# Altium schematic sheet LTC2194_0.SchDoc
size A; DrawnBy: Daniel Schussheim; DocumentNumber: 2; SheetNumber: 5; SheetTotal: 24
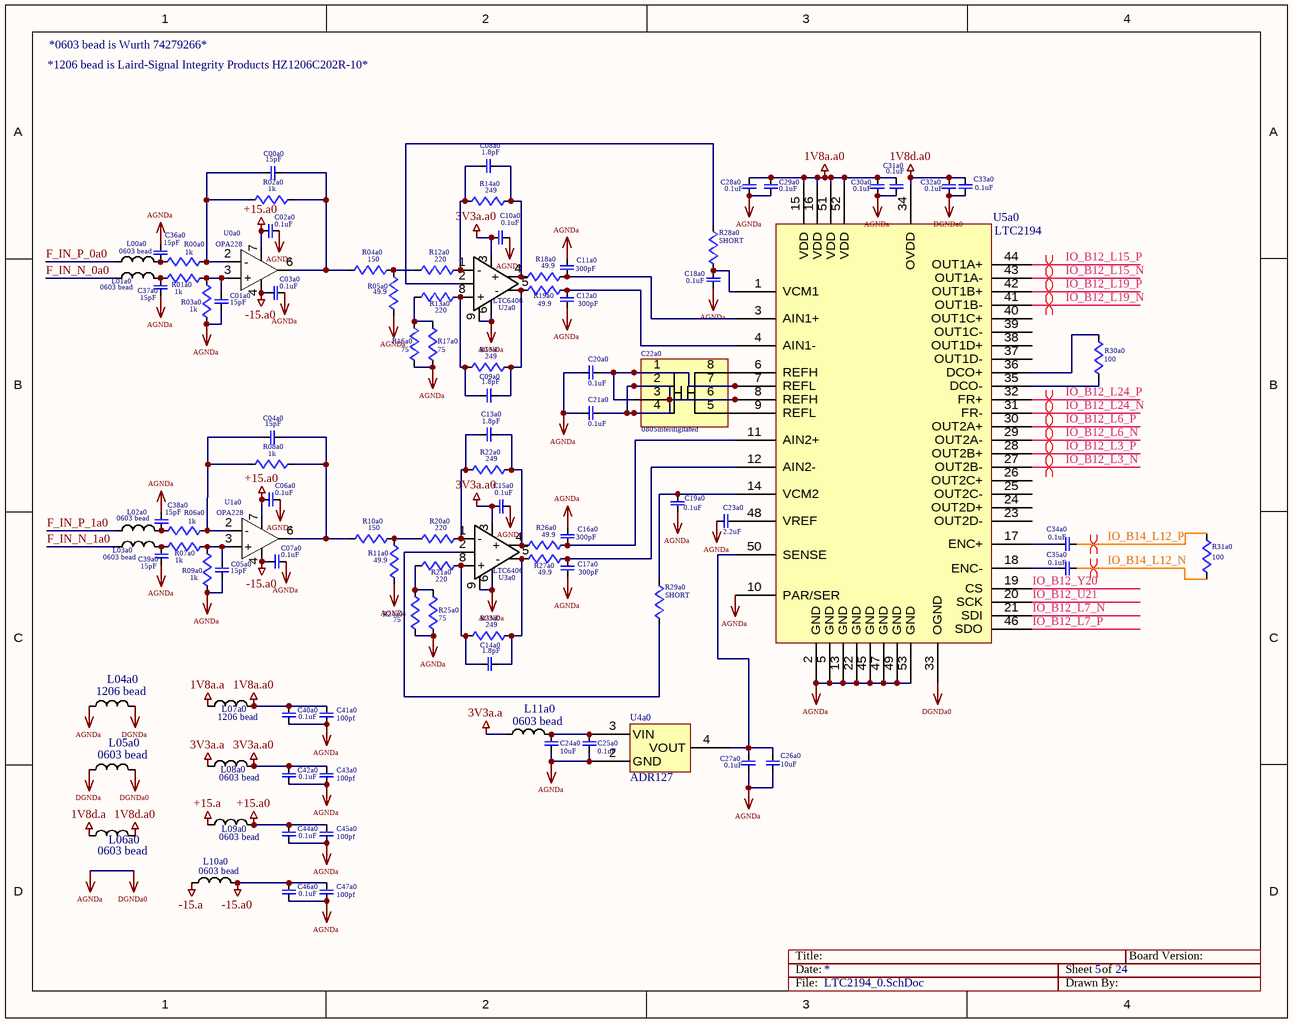
[diagram p0: LTC2194_0.SchDoc]

## Parts
C00a0  15pF  [0603]
C01a0  15pF  [0603]
C02a0  0.1uF  [0603]
C03a0  0.1uF  [0603]
C04a0  15pF  [0603]
C05a0  15pF  [0603]
C06a0  0.1uF  [0603]
C07a0  0.1uF  [0603]
C08a0  1.8pF  [0603]
C09a0  1.8pF  [0603]
C10a0  0.1uF  [0603]
C11a0  300pF  [0603]
C12a0  300pF  [0603]
C13a0  1.8pF  [0603]
C14a0  1.8pF  [0603]
C15a0  0.1uF  [0603]
C16a0  300pF  [0603]
C17a0  300pF  [0603]
C18a0  0.1uF  [0402]
C19a0  0.1uF  [0402]
C20a0  0.1uF  [0402]
C21a0  0.1uF  [0402]
C22a0  0805interdigitated  [0805int]
C23a0  2.2uF  [0402]
C24a0  10uF  [0603]
C25a0  0.1uF  [0603]
C26a0  10uF  [0603]
C27a0  0.1uF  [0603]
C28a0  0.1uF  [0402]
C29a0  0.1uF  [0402]
C30a0  0.1uF  [0402]
C31a0  0.1uF  [0402]
C32a0  0.1uF  [0402]
C33a0  0.1uF  [0402]
C34a0  0.1uF  [0402]
C35a0  0.1uF  [0402]
C36a0  15pF  [0603]
C37a0  15pF  [0603]
C38a0  15pF  [0603]
C39a0  15pF  [0603]
C40a0  0.1uF  [0603]
C41a0  100pf  [0603]
C42a0  0.1uF  [0603]
C43a0  100pf  [0603]
C44a0  0.1uF  [0603]
C45a0  100pf  [0603]
C46a0  0.1uF  [0603]
C47a0  100pf  [0603]
L00a0  0603 bead  [0603]
L01a0  0603 bead  [0603]
L02a0  0603 bead  [0603]
L03a0  0603 bead  [0603]
L04a0  1206 bead  [1206]
L05a0  0603 bead  [0603]
L06a0  0603 bead  [0603]
L07a0  1206 bead  [1206]
L08a0  0603 bead  [0603]
L09a0  0603 bead  [0603]
L10a0  0603 bead  [0603]
L11a0  0603 bead  [0603]
R00a0  1k  [0603]
R01a0  1k  [0603]
R02a0  1k  [0603]
R03a0  1k  [0603]
R04a0  150  [0603]
R05a0  49.9  [0603]
R06a0  1k  [0603]
R07a0  1k  [0603]
R08a0  1k  [0603]
R09a0  1k  [0603]
R10a0  150  [0603]
R11a0  49.9  [0603]
R12a0  220  [0603]
R13a0  220  [0603]
R14a0  249  [0603]
R15a0  249  [0603]
R16a0  75  [0603]
R17a0  75  [0603]
R18a0  49.9  [0603]
R19a0  49.9  [0603]
R20a0  220  [0603]
R21a0  220  [0603]
R22a0  249  [0603]
R23a0  249  [0603]
R24a0  75  [0603]
R25a0  75  [0603]
R26a0  49.9  [0603]
R27a0  49.9  [0603]
R28a0  SHORT  [0603]
R29a0  SHORT  [0603]
R30a0  100  [0603]
R31a0  100  [0402]
U0a0  OPA228  [8SOIC]
U1a0  OPA228  [8SOIC]
U2a0  LTC6406  [8MSOP]
U3a0  LTC6406  [8MSOP]
U4a0  ADR127  [6TSOT]
U5a0  LTC2194  [52QFN]

## Nets
1V8a.a: L07a0.1
1V8a.a0: C28a0.1 C29a0.1 C30a0.1 C31a0.1 C40a0.1 C41a0.1 L07a0.2 U5a0.15(VDD) U5a0.16(VDD) U5a0.51(VDD) U5a0.52(VDD)
1V8d.a: L06a0.1
1V8d.a0: C32a0.1 C33a0.2 L06a0.2 U5a0.34(OVDD)
3V3a.a: L08a0.1 L11a0.1
3V3a.a0: C10a0.1 C15a0.1 C42a0.1 C43a0.1 L08a0.2 U2a0.3(V+) U3a0.3(V+)
+15.a: L09a0.1
+15.a0: C02a0.2 C06a0.2 C44a0.1 C45a0.1 L09a0.2 U0a0.7(V+) U1a0.7(V+)
-15.a: L10a0.1
-15.a0: C03a0.2 C07a0.2 C46a0.1 C47a0.1 L10a0.2 U0a0.4(V-) U1a0.4(V-)
AGNDa: C01a0.2 C02a0.1 C03a0.1 C05a0.2 C06a0.1 C07a0.1 C10a0.2 C11a0.2 C12a0.1 C15a0.2 C16a0.2 C17a0.1 C18a0.1 C19a0.1 C20a0.2 C21a0.2 C23a0.2 C24a0.2 C25a0.2 C26a0.2 C27a0.2 C28a0.2 C29a0.2 C30a0.2 C31a0.2 C32a0.2 C33a0.1 C36a0.1 C37a0.2 C38a0.1 C39a0.2 C40a0.2 C41a0.2 C42a0.2 C43a0.2 C44a0.2 C45a0.2 C46a0.2 C47a0.2 L04a0.1 L05a0.2 R03a0.1 R05a0.2 R09a0.1 R11a0.2 R16a0.2 R17a0.2 R24a0.2 R25a0.2 U2a0.6(V-) U2a0.9(V-) U3a0.6(V-) U3a0.9(V-) U4a0.2(GND) U5a0.2(GND) U5a0.5(GND) U5a0.10(PAR/SER) U5a0.13(GND) U5a0.22(GND) U5a0.33(OGND) U5a0.45(GND) U5a0.47(GND) U5a0.49(GND) U5a0.53(GND)  [also labelled DGNDa0]
DGNDa: L04a0.2 L05a0.1
F_IN_N_0a0: L01a0.1
F_IN_N_1a0: L03a0.1
F_IN_P_0a0: L00a0.1
F_IN_P_1a0: L02a0.1
IO_B12_L3_N: U5a0.27(OUT2B-)
IO_B12_L3_P: U5a0.28(OUT2B+)
IO_B12_L6_N: U5a0.29(OUT2A-)
IO_B12_L6_P: U5a0.30(OUT2A+)
IO_B12_L7_N: U5a0.21(SDI)
IO_B12_L7_P: U5a0.46(SDO)
IO_B12_L15_N: U5a0.43(OUT1A-)
IO_B12_L15_P: U5a0.44(OUT1A+)
IO_B12_L19_N: U5a0.41(OUT1B-)
IO_B12_L19_P: U5a0.42(OUT1B+)
IO_B12_L24_N: U5a0.31(FR-)
IO_B12_L24_P: U5a0.32(FR+)
IO_B12_U21: U5a0.20(SCK)
IO_B12_Y20: U5a0.19(CS)
IO_B14_L12_N: C35a0.1 R31a0.2
IO_B14_L12_P: C34a0.1 R31a0.1
NetC00a0_1: C00a0.1 R00a0.1 R02a0.2 U0a0.2(-)
NetC00a0_2: C00a0.2 R02a0.1 R04a0.2 U0a0.6(OUT)
NetC01a0_1: C01a0.1 R01a0.1 R03a0.2 U0a0.3(+)
NetC04a0_1: C04a0.1 R06a0.1 R08a0.2 U1a0.2(-)
NetC04a0_2: C04a0.2 R08a0.1 R10a0.2 U1a0.6(OUT)
NetC05a0_1: C05a0.1 R07a0.1 R09a0.2 U1a0.3(+)
NetC08a0_1: C08a0.1 R12a0.1 R14a0.2 U2a0.1(-)
NetC08a0_2: C08a0.2 R14a0.1 R18a0.2 U2a0.4(+)
NetC09a0_1: C09a0.1 R13a0.1 R15a0.2 U2a0.8(+)
NetC09a0_2: C09a0.2 R15a0.1 R19a0.2 U2a0.5(-)
NetC11a0_1: C11a0.1 R18a0.1 U5a0.3(AIN1+)
NetC12a0_2: C12a0.2 R19a0.1 U5a0.4(AIN1-)
NetC13a0_1: C13a0.1 R20a0.1 R22a0.2 U3a0.1(-)
NetC13a0_2: C13a0.2 R22a0.1 R26a0.2 U3a0.4(+)
NetC14a0_1: C14a0.1 R21a0.1 R23a0.2 U3a0.8(+)
NetC14a0_2: C14a0.2 R23a0.1 R27a0.2 U3a0.5(-)
NetC16a0_1: C16a0.1 R26a0.1 U5a0.11(AIN2+)
NetC17a0_2: C17a0.2 R27a0.1 U5a0.12(AIN2-)
NetC18a0_2: C18a0.2 R28a0.2 U5a0.1(VCM1)
NetC19a0_2: C19a0.2 R29a0.1 U5a0.14(VCM2)
NetC20a0_1: C20a0.1 C22a0.1 C22a0.3 C22a0.7 U5a0.7(REFL)
NetC21a0_1: C21a0.1 C22a0.2 C22a0.4 C22a0.6 U5a0.8(REFH)
NetC22a0_5: C22a0.5 U5a0.9(REFL)
NetC22a0_8: C22a0.8 U5a0.6(REFH)
NetC23a0_1: C23a0.1 U5a0.48(VREF)
NetC24a0_1: C24a0.1 C25a0.1 L11a0.2 U4a0.3(VIN)
NetC26a0_1: C26a0.1 C27a0.1 U4a0.4(VOUT) U5a0.50(SENSE)
NetC34a0_2: C34a0.2 U5a0.17(ENC+)
NetC35a0_2: C35a0.2 U5a0.18(ENC-)
NetC36a0_2: C36a0.2 L00a0.2 R00a0.2
NetC37a0_1: C37a0.1 L01a0.2 R01a0.2
NetC38a0_2: C38a0.2 L02a0.2 R06a0.2
NetC39a0_1: C39a0.1 L03a0.2 R07a0.2
NetR04a0_1: R04a0.1 R05a0.1 R12a0.2
NetR10a0_1: R10a0.1 R11a0.1 R20a0.2
NetR13a0_2: R13a0.2 R16a0.1 R17a0.1
NetR21a0_2: R21a0.2 R24a0.1 R25a0.1
NetR28a0_1: R28a0.1 U2a0.2(VOCM)
NetR29a0_2: R29a0.2 U3a0.2(VOCM)
NetR30a0_1: R30a0.1 U5a0.36(DCO+)
NetR30a0_2: R30a0.2 U5a0.35(DCO-)

Not connected (* = marked no-connect by the designer): U5a0 23(OUT2D-) 24(OUT2D+) 25(OUT2C-) 26(OUT2C+) 37(OUT1D-) 38(OUT1D+) 39(OUT1C-) 40(OUT1C+)

## Layout directives
differential pair: IO_B12_L3_N, IO_B12_L3_P, IO_B12_L6_N, IO_B12_L6_P, IO_B12_L15_N, IO_B12_L15_P, IO_B12_L19_N, IO_B12_L19_P, IO_B12_L24_N, IO_B12_L24_P, IO_B14_L12_N, IO_B14_L12_P

## Notes on the sheet
- *1206 bead is Laird-Signal Integrity Products HZ1206C202R-10*
- *0603 bead is Wurth 74279266*
- Title:
- Date:
- Sheet
- of
- Board Version:
- File:
- Drawn By:

## Library data of the parts
C00a0 C01a0 C02a0 C03a0 C04a0 C05a0 C06a0 C07a0 C08a0 C09a0 C10a0 C11a0 C12a0 C13a0 C14a0 C15a0 C16a0 C17a0 C18a0 C19a0 C20a0 C21a0 C23a0 C24a0 C25a0 C26a0 C27a0 C28a0 C29a0 C30a0 C31a0 C32a0 C33a0 C34a0 C35a0 C36a0 C37a0 C38a0 C39a0 C40a0 C41a0 C42a0 C43a0 C44a0 C45a0 C46a0 C47a0 = CAP
C22a0 = 0805intCap
L00a0 L01a0 L02a0 L03a0 L04a0 L05a0 L06a0 L07a0 L08a0 L09a0 L10a0 L11a0 = INDUCTOR
R00a0 R01a0 R02a0 R03a0 R04a0 R05a0 R06a0 R07a0 R08a0 R09a0 R10a0 R11a0 R12a0 R13a0 R14a0 R15a0 R16a0 R17a0 R18a0 R19a0 R20a0 R21a0 R22a0 R23a0 R24a0 R25a0 R26a0 R27a0 R28a0 R29a0 R30a0 R31a0 = RES
U0a0 U1a0 = LF356
U4a0 = ADR12x